# Altium schematic sheet Hmi.SchDoc
size A4
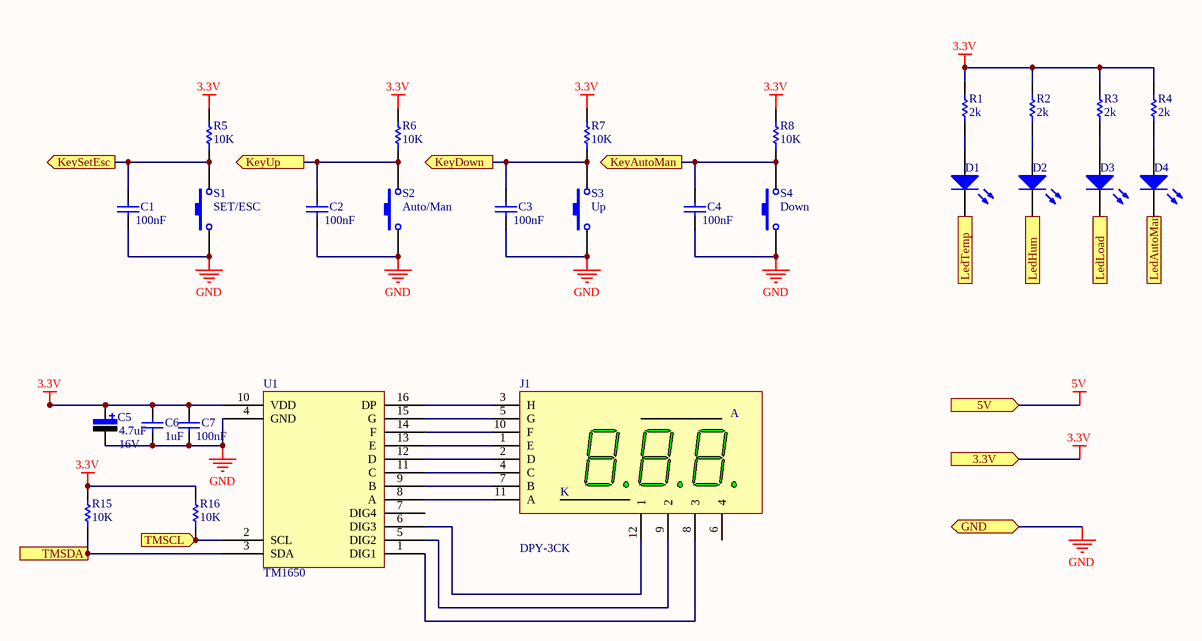
[diagram p0: Hmi.SchDoc]

## Parts
C1  100nF (104) 10% 50V  [0603_C]  (value not drawn)
C2  100nF (104) 10% 50V  [0603_C]  (value not drawn)
C3  100nF (104) 10% 50V  [0603_C]  (value not drawn)
C4  100nF (104) 10% 50V  [0603_C]  (value not drawn)
C5  value 4.7uF  Vol: 16V  [CAP-1206]  (hidden comment: 4.7uF/16V)
C6  1uF (105) 10% 50V  [0603_C]  (value not drawn)
C7  100nF (104) 10% 50V  [0603_C]  (value not drawn)
D1  LED  [LED(小)]  (value not drawn)
D2  LED  [LED(小)]  (value not drawn)
D3  LED  [LED(小)]  (value not drawn)
D4  LED  [LED(小)]  (value not drawn)
J1  DPY-3CK  [DYP-3BIT_2.8]
R1  2k  [0603_R]
R2  2k  [0603_R]
R3  2k  [0603_R]
R4  2k  [0603_R]
R5  10K  [0603_R]
R6  10K  [0603_R]
R7  10K  [0603_R]
R8  10K  [0603_R]
R15  10K  [0603_R]
R16  10K  [0603_R]
S1  SET/ESC  [Switch_4_6*6]
S2  Auto/Man  [Switch_4_6*6]
S3  Up  [Switch_4_6*6]
S4  Down  [Switch_4_6*6]
U1  TM1650  [SOIC-16_150mil]

## Ports
3.3V (in), 5V (in), GND (bidir), KeyAutoMan (out), KeyDown (out), KeySetEsc (out), KeyUp (out), LedAutoMan (in), LedHum (in), LedLoad (in), LedTemp (in), TMSCL (in), TMSDA (in)

## Nets
3.3V: C5.1 C6.2 C7.2 R1.1 R2.1 R3.1 R4.1 R5.2 R6.2 R7.2 R8.2 R15.2 R16.2 U1.10(VDD) ; port 3.3V
5V: port 5V
GND: C1.1 C2.1 C3.1 C4.1 C5.2 C6.1 C7.1 S1.1 S2.1 S3.1 S4.1 U1.4(GND) ; port GND
KeyAutoMan: C4.2 R8.1 S4.2 ; port KeyAutoMan
KeyDown: C3.2 R7.1 S3.2 ; port KeyDown
KeySetEsc: C1.2 R5.1 S1.2 ; port KeySetEsc
KeyUp: C2.2 R6.1 S2.2 ; port KeyUp
LedAutoMan: D4.2(K) ; port LedAutoMan
LedHum: D2.2(K) ; port LedHum
LedLoad: D3.2(K) ; port LedLoad
LedTemp: D1.2(K) ; port LedTemp
TMSCL: R16.1 U1.2(SCL) ; port TMSCL
TMSDA: R15.1 U1.3(SDA) ; port TMSDA
NetD1_1: D1.1(A) R1.2
NetD2_1: D2.1(A) R2.2
NetD3_1: D3.1(A) R3.2
NetD4_1: D4.1(A) R4.2
NetJ1_1: J1.1(E) U1.13(E)
NetJ1_2: J1.2(D) U1.12(D)
NetJ1_3: J1.3(H) U1.16(DP)
NetJ1_4: J1.4(C) U1.11(C)
NetJ1_5: J1.5(G) U1.15(G)
NetJ1_7: J1.7(B) U1.9(B)
NetJ1_8: J1.8(3) U1.1(DIG1)
NetJ1_9: J1.9(2) U1.5(DIG2)
NetJ1_10: J1.10(F) U1.14(F)
NetJ1_11: J1.11(A) U1.8(A)
NetJ1_12: J1.12(1) U1.6(DIG3)

Not connected (* = marked no-connect by the designer): J1 6(4); U1 7(DIG4)

## Notes on the sheet
- (in symbol 0603 1uF (105) 10% 50V) 1uF
- (in symbol 0603 100nF (104) 10% 50V) 100nF
- (in symbol DPY-3CK_1) K

## Library data of the parts
C1-C4 C7 = 0603 100nF (104) 10% 50V: 贴片电容; ComponentLink1Description: 供应商链接; ComponentLink1URL: http://www.szlcsc.com/product/details_15331.html; Package: 0603; Supplier: LC; SuppliersPartNumber: C14663
C5 = Cap Pol: 4.7uF/16V钽电容; Published: 8-Jun-2000; LatestRevisionDate: 17-Jul-2002; LatestRevisionNote: Re-released for DXP Platform.; PackageReference: RB7.6-15; Publisher: Altium Limited
C6 = 0603 1uF (105) 10% 50V: 贴片电容; ComponentLink1Description: 供应商链接; ComponentLink1URL: http://www.szlcsc.com/product/details_16531.html; Package: 0603; Supplier: LC; SuppliersPartNumber: C15849
D1-D4 = LED0: Typical INFRARED GaAs LED; Published: 8-Jun-2000; LatestRevisionDate: 08-Jul-2005; LatestRevisionNote: Mech Layer 1 removed.; PackageReference: LED-0; Publisher: Altium Limited
J1 = DPY-3CK_1: 共阴3位数码管
R1-R4 = RES1: 2k/±10%; 零件名称: 贴片电阻
R5-R8 R15 R16 = RES1: 10K/±10%; 零件名称: 贴片电阻
S1-S4 = SW-PB: 6*6*5四脚直插轻触开关; 零件名称: 直插开关